# EasyEDA schematic SCH_LightScader-Extender-1.0_2026-06-06.json
TITLE: LightScader Extender; REV: 1.0; Date: 2023-06-07; Sheet: 1/1; Drawn By: robdobsn; Company: Rob Dobson
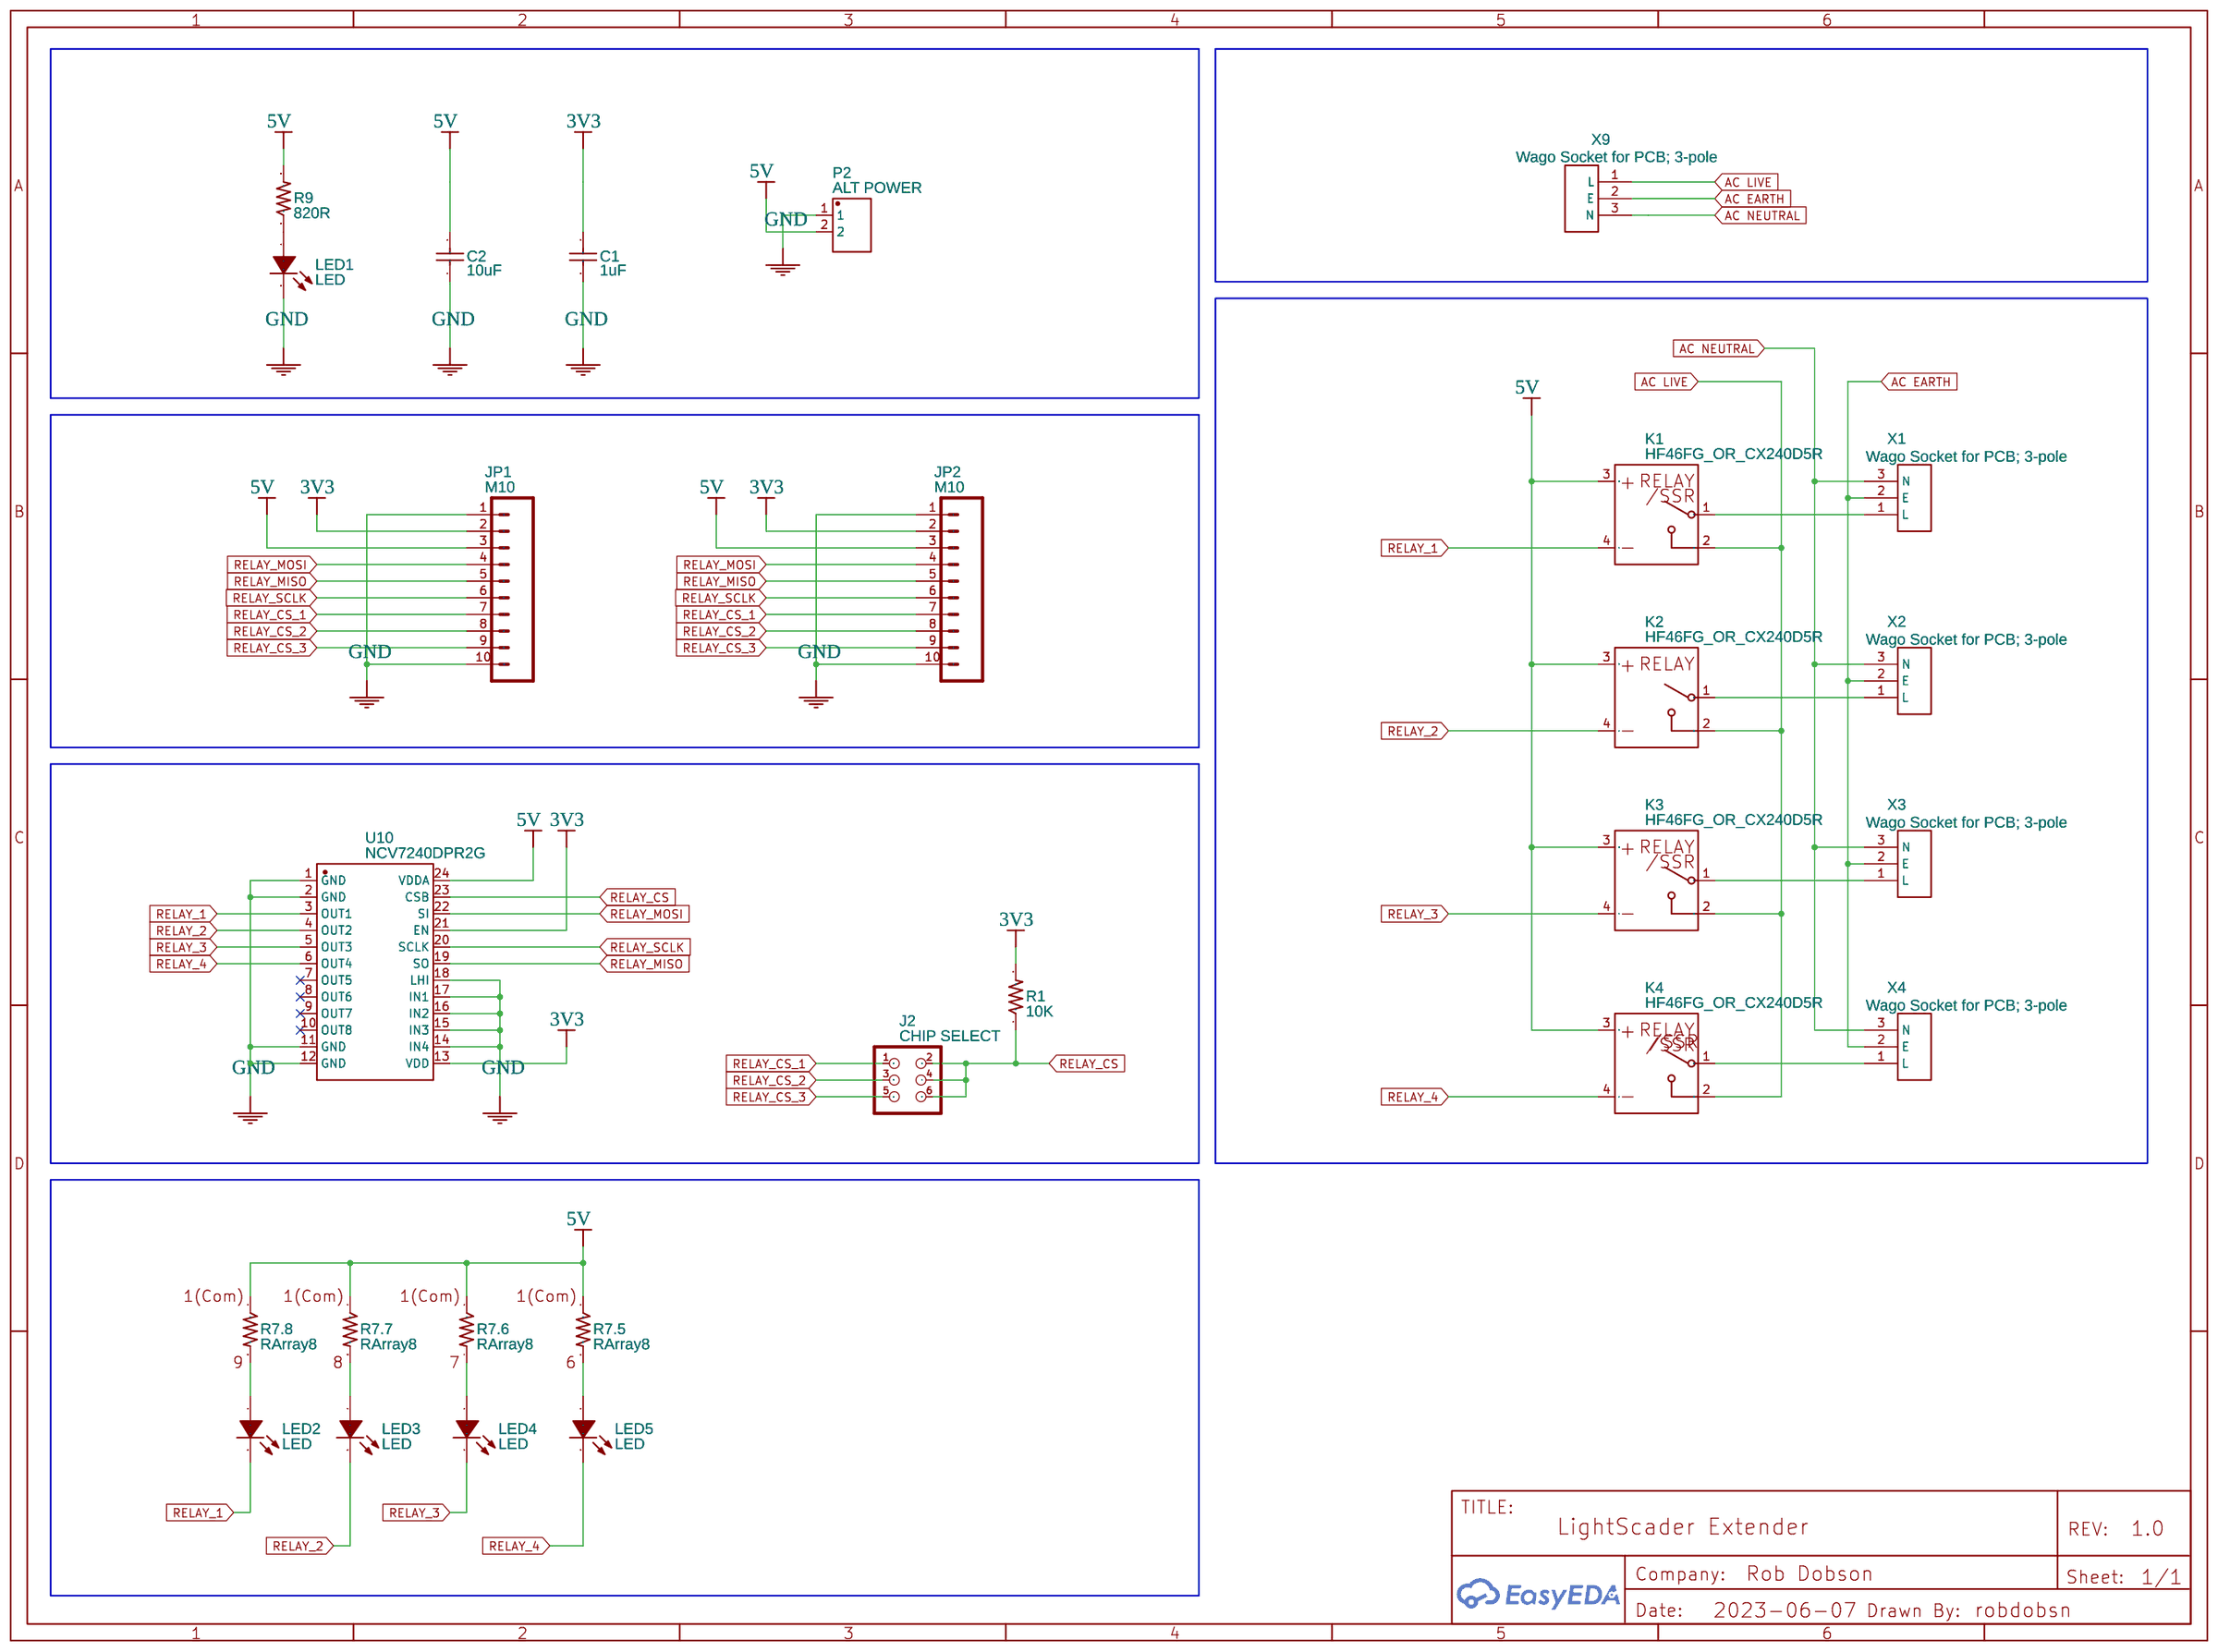
[diagram p0: schematic sheet]

## Parts
C1  1uF  [CERAMIC CAP 2.5MM LEAD SPACING]
C2  10uF  [CERAMIC CAP 2.5MM LEAD SPACING]
J2  CHIP SELECT  [2X03_NO_SILK]
JP1  M10  [1X10_NO_SILK]
JP2  M10  [1X10_NO_SILK]
K1  HF46FG_OR_CX240D5R  [HF46FG_OR_CX240D5R]
K2  HF46FG_OR_CX240D5R  [HF46FG_OR_CX240D5R]
K3  HF46FG_OR_CX240D5R  [HF46FG_OR_CX240D5R]
K4  HF46FG_OR_CX240D5R  [HF46FG_OR_CX240D5R]
LED1  LED  [LED-TH_BD3.8-P2.54-FD]
LED2  LED  [LED-TH_BD3.8-P2.54-FD]
LED3  LED  [LED-TH_BD3.8-P2.54-FD]
LED4  LED  [LED-TH_BD3.8-P2.54-FD]
LED5  LED  [LED-TH_BD3.8-P2.54-FD]
P2  ALT POWER  [PCB TERMINAL BLOCK NO SILK 3.5 MM]
R1  10K  [AXIAL-5.0X2.5(1/4W)]
R7  RArray8  [RESISTOR_ARRAY_SIP_9]  (sections 5,6,7,8)
R9  820R  [AXIAL-5.0X2.5(1/4W)]
U10  NCV7240DPR2G  [SSOP-24_L8.75-W6.20-PITCH0.64-BL]
X1  Wago Socket for PCB; 3-pole  [WAGO SOCKET FOR PCBS; ANGLED; 3-POLE; COD. A]
X2  Wago Socket for PCB; 3-pole  [WAGO SOCKET FOR PCBS; ANGLED; 3-POLE; COD. A]
X3  Wago Socket for PCB; 3-pole  [WAGO SOCKET FOR PCBS; ANGLED; 3-POLE; COD. A]
X4  Wago Socket for PCB; 3-pole  [WAGO SOCKET FOR PCBS; ANGLED; 3-POLE; COD. A]
X9  Wago Socket for PCB; 3-pole  [WAGO SOCKET FOR PCBS; ANGLED; 3-POLE; COD. A]

## Library data of the parts
C1 C2 = -: Voltage: 100V; Tolerance: ±20%; Supplier Part: 9411887; Supplier: Element14; Manufacturer Part: MCFYU6104Z6; Contributor: Prof. Ing. F. Scordino; Link: http://www.farnell.com/datasheets/296858.pdf?_ga=2.179112227.664711881.1510158588-238689616.1505921947&_gac=1.162203016.1510158588.EAIaIQobChMIqoD3jrOv1wIVgwrTCh2CCwl7EAAYASAAEgKQo_D_BwE
J2 = -: Contributor: DangerousPrototype; sourceId: 5oAa8IGDB
JP1 JP2 = -: Contributor: SparkFun
K1 = HF46FG_OR_CX240D5R: Supplier: LCSC; Manufacturer: Hongfa; Manufacturer Part: HF46F-G; Supplier Part: C3636; link: https://hongfa.com/product/detail/b65de757-aff1-49f8-b955-95a7fcb786dc; Contributor: robdobsn; Package Display: No
K2-K4 = HF46FG_OR_CX240D5R: Supplier: LCSC; Manufacturer: Hongfa; Manufacturer Part: HF46F-G; Supplier Part: C3636; link: https://hongfa.com/product/detail/b65de757-aff1-49f8-b955-95a7fcb786dc; Contributor: robdobsn
LED1-LED5 = -: Supplier: LCSC; Manufacturer: KENTO; Manufacturer Part: LEDOrange orange 3AO4UD; image: //image.lceda.cn/szlcsc/C62095.jpg; Supplier Part: C62095
P2 = -: Supplier: LCSC; Manufacturer: ReliaPro; Manufacturer Part: WJ2EDGV-5.08-2P; image: //image.lceda.cn/szlcsc/C8461.jpg; Contributor: robdobsn; Supplier Part: C8461
R1 R9 = -: Contributor: SparkFun; Manufacturer Part: ?
R7 = -: Contributor: robdobsn; Supplier Part: 652-4609X-1LF-10K; Supplier: Mouser; Manufacturer: Bourns; Manufacturer Part: 4609X-101-103LF; subpart_no: 1; Package Display: No
U10 = -: Supplier: LCSC; Supplier Part: C385196; Manufacturer: ON Semicon; Contributor: LCSC
X1-X4 X9 = Wago Socket for PCBs; angled; 3-pole; Cod. A: Manufacturer: Wago; Manufacturer Part: 890-803/011-000; Supplier: Rapid; Supplier Part: 21-5984; link: https://www.rapidonline.com/wago-890-803-011-000-3-pole-16a-4-4mm-pcb-mount-socket-angled-black-21-5984; Contributor: robdobsn

## Nets
3V3: C1.2 JP1.2 JP2.2 R1.2 U10.13(VDD) U10.21(EN)
5V: C2.2 JP1.3 JP2.3 K1.3 K2.3 K3.3 K4.3 P2.2 R7.1 R9.2 U10.24(VDDA)
GND: C1.1 C2.1 JP1.1 JP1.10 JP2.1 JP2.10 LED1.2(K) P2.1 U10.1(GND) U10.2(GND) U10.11(GND) U10.12(GND) U10.14(IN4) U10.15(IN3) U10.16(IN2) U10.17(IN1) U10.18(LHI)
AC EARTH: X1.2(E) X2.2(E) X3.2(E) X4.2(E) X9.2(E)
AC LIVE: K1.2 K2.2 K3.2 K4.2 X9.1(L)
AC NEUTRAL: X1.3(N) X2.3(N) X3.3(N) X4.3(N) X9.3(N)
RELAY_1: K1.4 LED2.2(K) U10.3(OUT1)
RELAY_2: K2.4 LED3.2(K) U10.4(OUT2)
RELAY_3: K3.4 LED4.2(K) U10.5(OUT3)
RELAY_4: K4.4 LED5.2(K) U10.6(OUT4)
RELAY_CS: J2.2 J2.4 J2.6 R1.1 U10.23(CSB)
RELAY_CS_1: J2.1 JP1.7 JP2.7
RELAY_CS_2: J2.3 JP1.8 JP2.8
RELAY_CS_3: J2.5 JP1.9 JP2.9
RELAY_MISO: JP1.5 JP2.5 U10.19(SO)
RELAY_MOSI: JP1.4 JP2.4 U10.22(SI)
RELAY_SCLK: JP1.6 JP2.6 U10.20(SCLK)
Net-(K1-1): K1.1 X1.1(L)
Net-(K2-1): K2.1 X2.1(L)
Net-(K3-1): K3.1 X3.1(L)
Net-(K4-1): K4.1 X4.1(L)
Net-(LED1-1): LED1.1(A) R9.1
Net-(LED2-1): LED2.1(A) R7.9
Net-(LED3-1): LED3.1(A) R7.8
Net-(LED4-1): LED4.1(A) R7.7
Net-(LED5-1): LED5.1(A) R7.6

Not connected (* = marked no-connect by the designer): U10 7(OUT5)* 8(OUT6)* 9(OUT7)* 10(OUT8)*
